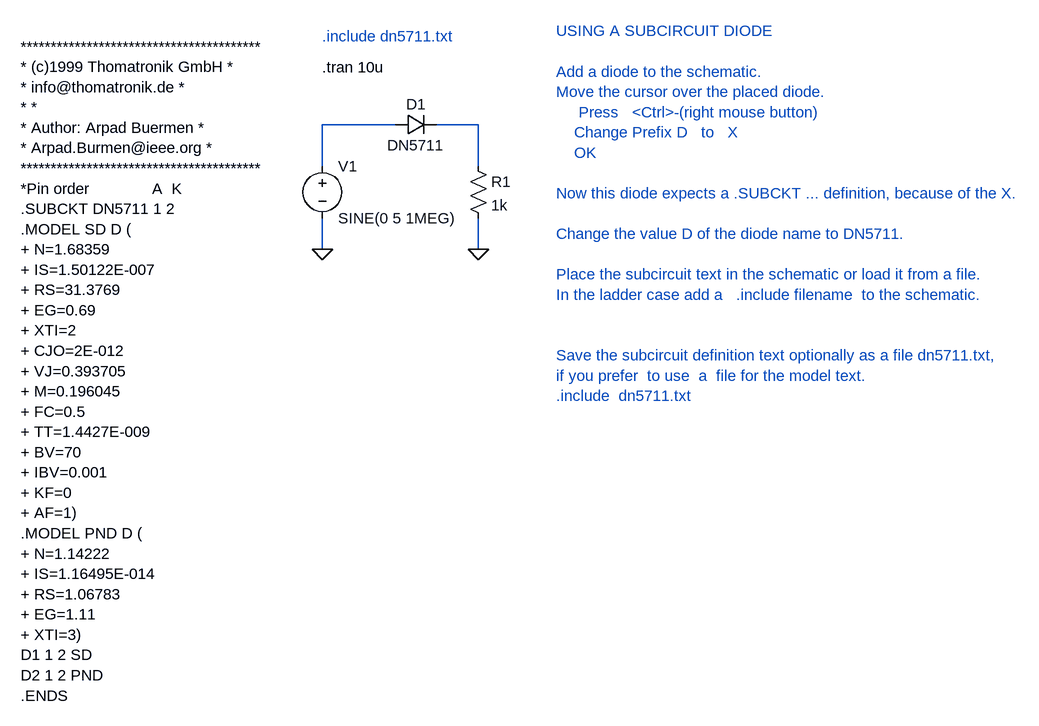
[diagram p0: schematic DN5711_test.asc]
DN5711_test.asc, the LTspice schematic file:
Version 4
SHEET 1 1488 1320
WIRE 32 128 -80 128
WIRE -80 128 -80 192
WIRE -80 272 -80 320
WIRE 96 128 160 128
WIRE 160 128 160 192
WIRE 160 272 160 320
FLAG -80 320 0
FLAG 160 320 0
SYMBOL diode 32 144 R270
WINDOW 0 32 32 VTop 0
WINDOW 3 0 32 VBottom 0
SYMATTR InstName D1
SYMATTR Value DN5711
SYMATTR Prefix X
SYMBOL voltage -80 176 R0
WINDOW 123 0 0 Left 0
WINDOW 39 0 0 Left 0
SYMATTR InstName V1
SYMATTR Value SINE(0 5 1MEG)
SYMBOL res 144 176 R0
SYMATTR InstName R1
SYMATTR Value 1k
TEXT -80 40 Left 0 !.tran 10u
TEXT -544 8 Left 0 !****************************************\n* (c)1999 Thomatronik GmbH *\n* info@thomatronik.de *\n* *\n* Author: Arpad Buermen *\n* Arpad.Burmen@ieee.org *\n****************************************\n*Pin order              A  K\n.SUBCKT DN5711 1 2\n.MODEL SD D (\n+ N=1.68359\n+ IS=1.50122E-007\n+ RS=31.3769\n+ EG=0.69\n+ XTI=2\n+ CJO=2E-012\n+ VJ=0.393705\n+ M=0.196045\n+ FC=0.5\n+ TT=1.4427E-009\n+ BV=70\n+ IBV=0.001\n+ KF=0\n+ AF=1)\n.MODEL PND D (\n+ N=1.14222\n+ IS=1.16495E-014\n+ RS=1.06783\n+ EG=1.11\n+ XTI=3)\nD1 1 2 SD\nD2 1 2 PND\n.ENDS
TEXT 280 -16 Left 0 ;USING A SUBCIRCUIT DIODE\n \nAdd a diode to the schematic.\nMove the cursor over the placed diode.\n     Press   <Ctrl>-(right mouse button)   \n    Change Prefix D   to   X\n    OK\n \nNow this diode expects a .SUBCKT ... definition, because of the X.\n \nChange the value D of the diode name to DN5711.\n \nPlace the subcircuit text in the schematic or load it from a file.\nIn the ladder case add a   .include filename  to the schematic.\n \n \nSave the subcircuit definition text optionally as a file dn5711.txt, \nif you prefer  to use  a  file for the model text. \n.include  dn5711.txt
TEXT -80 -8 Left 0 ;.include dn5711.txt

The netlist it stands for:
* DN5711_test.asc
XD1 N001 N002 DN5711  ; pins + -
V1 N001 0 SINE(0 5 1MEG)
R1 N002 0 1k
.tran 10u
****************************************
* (c)1999 Thomatronik GmbH *
* info@thomatronik.de *
* *
* Author: Arpad Buermen *
* Arpad.Burmen@ieee.org *
****************************************
*Pin order              A  K
.SUBCKT DN5711 1 2
.MODEL SD D (
+ N=1.68359
+ IS=1.50122E-007
+ RS=31.3769
+ EG=0.69
+ XTI=2
+ CJO=2E-012
+ VJ=0.393705
+ M=0.196045
+ FC=0.5
+ TT=1.4427E-009
+ BV=70
+ IBV=0.001
+ KF=0
+ AF=1)
.MODEL PND D (
+ N=1.14222
+ IS=1.16495E-014
+ RS=1.06783
+ EG=1.11
+ XTI=3)
D1 1 2 SD
D2 1 2 PND
.ENDS
* USING A SUBCIRCUIT DIODE
* Add a diode to the schematic.
* Move the cursor over the placed diode.
*      Press   <Ctrl>-(right mouse button)
*     Change Prefix D   to   X
*     OK
* Now this diode expects a .SUBCKT ... definition, because of the X.
* Change the value D of the diode name to DN5711.
* Place the subcircuit text in the schematic or load it from a file.
* In the ladder case add a   .include filename  to the schematic.
* Save the subcircuit definition text optionally as a file dn5711.txt,
* if you prefer  to use  a  file for the model text.
* .include  dn5711.txt
* .include dn5711.txt
.backanno
.end